# Altium schematic sheet RAM_LPDDR4.SchDoc
size A3; SheetNumber: 12; SheetTotal: 22
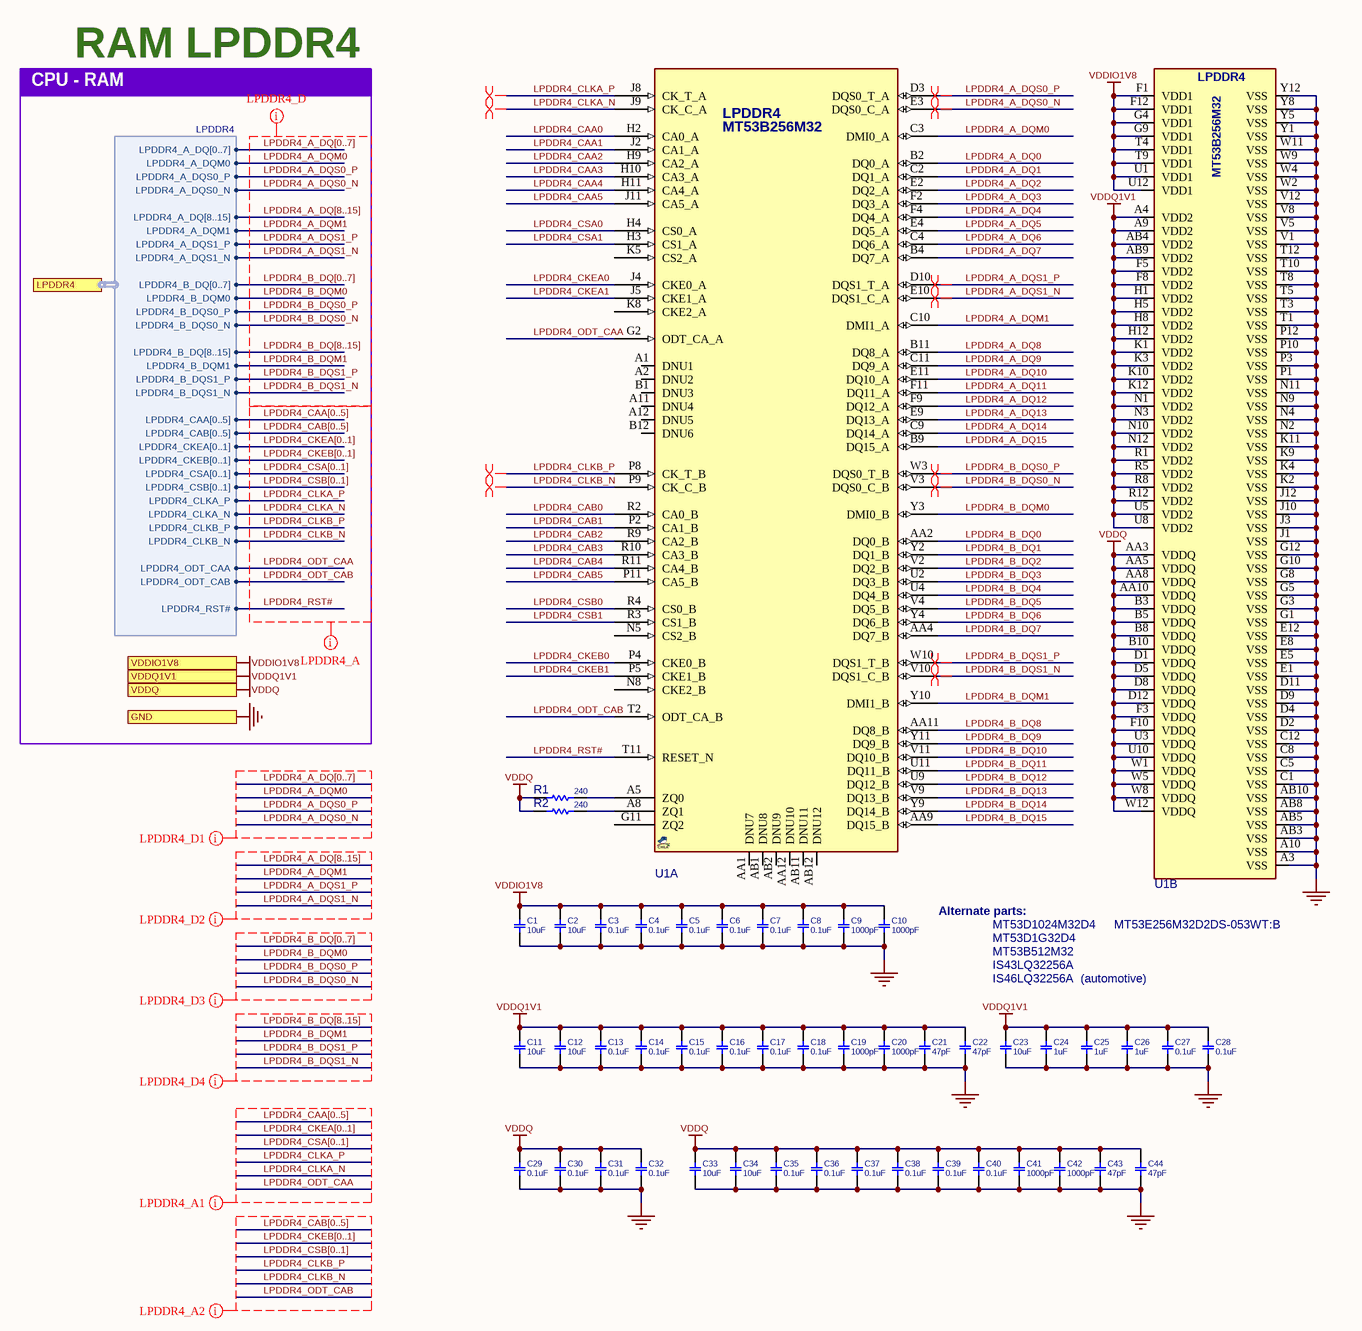
[diagram p0: RAM_LPDDR4.SchDoc]

## Parts
C1  10uF  [C0402A]
C2  10uF  [C0402A]
C3  0.1uF  [C0402A]
C4  0.1uF  [C0402A]
C5  0.1uF  [C0402A]
C6  0.1uF  [C0402A]
C7  0.1uF  [C0402A]
C8  0.1uF  [C0402A]
C9  1000pF  [C0402A]
C10  1000pF  [C0402A]
C11  10uF  [C0402A]
C12  10uF  [C0402A]
C13  0.1uF  [C0402A]
C14  0.1uF  [C0402A]
C15  0.1uF  [C0402A]
C16  0.1uF  [C0402A]
C17  0.1uF  [C0402A]
C18  0.1uF  [C0402A]
C19  1000pF  [C0402A]
C20  1000pF  [C0402A]
C21  47pF  [C0402A]
C22  47pF  [C0402A]
C23  10uF  [C0402A]
C24  1uF  [C0402A]
C25  1uF  [C0402A]
C26  1uF  [C0402A]
C27  0.1uF  [C0402A]
C28  0.1uF  [C0402A]
C29  0.1uF  [C0402A]
C30  0.1uF  [C0402A]
C31  0.1uF  [C0402A]
C32  0.1uF  [C0402A]
C33  10uF  [C0402A]
C34  10uF  [C0402A]
C35  0.1uF  [C0402A]
C36  0.1uF  [C0402A]
C37  0.1uF  [C0402A]
C38  0.1uF  [C0402A]
C39  0.1uF  [C0402A]
C40  0.1uF  [C0402A]
C41  1000pF  [C0402A]
C42  1000pF  [C0402A]
C43  47pF  [C0402A]
C44  47pF  [C0402A]
R1  240  [R0402A]
R2  240  [R0402A]
U1  LPDDR4_MT53B256M32  [BGA65_200_11x14]  (value not drawn)  (parts A,B of 2)

## Ports
GND, LPDDR4 (harness LPDDR4), VDDIO1V8, VDDQ, VDDQ1V1

## Harnesses
LPDDR4: LPDDR4_A_DQ[0..7], LPDDR4_A_DQM0, LPDDR4_A_DQS0_P, LPDDR4_A_DQS0_N, LPDDR4_A_DQ[8..15], LPDDR4_A_DQM1, LPDDR4_A_DQS1_P, LPDDR4_A_DQS1_N, LPDDR4_B_DQ[0..7], LPDDR4_B_DQM0, LPDDR4_B_DQS0_P, LPDDR4_B_DQS0_N, LPDDR4_B_DQ[8..15], LPDDR4_B_DQM1, LPDDR4_B_DQS1_P, LPDDR4_B_DQS1_N, LPDDR4_CAA[0..5], LPDDR4_CAB[0..5], LPDDR4_CKEA[0..1], LPDDR4_CKEB[0..1], LPDDR4_CSA[0..1], LPDDR4_CSB[0..1], LPDDR4_CLKA_P, LPDDR4_CLKA_N, LPDDR4_CLKB_P, LPDDR4_CLKB_N, LPDDR4_RST#, LPDDR4_ODT_CAA, LPDDR4_ODT_CAB

## Nets
GND: C1.1 C2.1 C3.1 C4.1 C5.1 C6.1 C7.1 C8.1 C9.1 C10.1 C11.1 C12.1 C13.1 C14.1 C15.1 C16.1 C17.1 C18.1 C19.1 C20.1 C21.1 C22.1 C23.1 C24.1 C25.1 C26.1 C27.1 C28.1 C29.1 C30.1 C31.1 C32.1 C33.1 C34.1 C35.1 C36.1 C37.1 C38.1 C39.1 C40.1 C41.1 C42.1 C43.1 C44.1 U1.A3(VSS) U1.A10(VSS) U1.AB3(VSS) U1.AB5(VSS) U1.AB8(VSS) U1.AB10(VSS) U1.C1(VSS) U1.C5(VSS) U1.C8(VSS) U1.C12(VSS) U1.D2(VSS) U1.D4(VSS) U1.D9(VSS) U1.D11(VSS) U1.E1(VSS) U1.E5(VSS) U1.E8(VSS) U1.E12(VSS) U1.G1(VSS) U1.G3(VSS) U1.G5(VSS) U1.G8(VSS) U1.G10(VSS) U1.G12(VSS) U1.J1(VSS) U1.J3(VSS) U1.J10(VSS) U1.J12(VSS) U1.K2(VSS) U1.K4(VSS) U1.K9(VSS) U1.K11(VSS) U1.N2(VSS) U1.N4(VSS) U1.N9(VSS) U1.N11(VSS) U1.P1(VSS) U1.P3(VSS) U1.P10(VSS) U1.P12(VSS) U1.T1(VSS) U1.T3(VSS) U1.T5(VSS) U1.T8(VSS) U1.T10(VSS) U1.T12(VSS) U1.V1(VSS) U1.V5(VSS) U1.V8(VSS) U1.V12(VSS) U1.W2(VSS) U1.W4(VSS) U1.W9(VSS) U1.W11(VSS) U1.Y1(VSS) U1.Y5(VSS) U1.Y8(VSS) U1.Y12(VSS) ; port GND
VDDIO1V8: C1.2 C2.2 C3.2 C4.2 C5.2 C6.2 C7.2 C8.2 C9.2 C10.2 U1.F1(VDD1) U1.F12(VDD1) U1.G4(VDD1) U1.G9(VDD1) U1.T4(VDD1) U1.T9(VDD1) U1.U1(VDD1) U1.U12(VDD1) ; port VDDIO1V8
VDDQ: C29.2 C30.2 C31.2 C32.2 C33.2 C34.2 C35.2 C36.2 C37.2 C38.2 C39.2 C40.2 C41.2 C42.2 C43.2 C44.2 R1.1 R2.1 U1.AA3(VDDQ) U1.AA5(VDDQ) U1.AA8(VDDQ) U1.AA10(VDDQ) U1.B3(VDDQ) U1.B5(VDDQ) U1.B8(VDDQ) U1.B10(VDDQ) U1.D1(VDDQ) U1.D5(VDDQ) U1.D8(VDDQ) U1.D12(VDDQ) U1.F3(VDDQ) U1.F10(VDDQ) U1.U3(VDDQ) U1.U10(VDDQ) U1.W1(VDDQ) U1.W5(VDDQ) U1.W8(VDDQ) U1.W12(VDDQ) ; port VDDQ
VDDQ1V1: C11.2 C12.2 C13.2 C14.2 C15.2 C16.2 C17.2 C18.2 C19.2 C20.2 C21.2 C22.2 C23.2 C24.2 C25.2 C26.2 C27.2 C28.2 U1.A4(VDD2) U1.A9(VDD2) U1.AB4(VDD2) U1.AB9(VDD2) U1.F5(VDD2) U1.F8(VDD2) U1.H1(VDD2) U1.H5(VDD2) U1.H8(VDD2) U1.H12(VDD2) U1.K1(VDD2) U1.K3(VDD2) U1.K10(VDD2) U1.K12(VDD2) U1.N1(VDD2) U1.N3(VDD2) U1.N10(VDD2) U1.N12(VDD2) U1.R1(VDD2) U1.R5(VDD2) U1.R8(VDD2) U1.R12(VDD2) U1.U5(VDD2) U1.U8(VDD2) ; port VDDQ1V1
LPDDR4_A_DQ0: U1.B2(DQ0_A)
LPDDR4_A_DQ1: U1.C2(DQ1_A)
LPDDR4_A_DQ2: U1.E2(DQ2_A)
LPDDR4_A_DQ3: U1.F2(DQ3_A)
LPDDR4_A_DQ4: U1.F4(DQ4_A)
LPDDR4_A_DQ5: U1.E4(DQ5_A)
LPDDR4_A_DQ6: U1.C4(DQ6_A)
LPDDR4_A_DQ7: U1.B4(DQ7_A)
LPDDR4_A_DQ8: U1.B11(DQ8_A)
LPDDR4_A_DQ9: U1.C11(DQ9_A)
LPDDR4_A_DQ10: U1.E11(DQ10_A)
LPDDR4_A_DQ11: U1.F11(DQ11_A)
LPDDR4_A_DQ12: U1.F9(DQ12_A)
LPDDR4_A_DQ13: U1.E9(DQ13_A)
LPDDR4_A_DQ14: U1.C9(DQ14_A)
LPDDR4_A_DQ15: U1.B9(DQ15_A)
LPDDR4_A_DQM0: U1.C3(DMI0_A) ; port LPDDR4.LPDDR4_A_DQM0
LPDDR4_A_DQM1: U1.C10(DMI1_A) ; port LPDDR4.LPDDR4_A_DQM1
LPDDR4_A_DQS0_N: U1.E3(DQS0_C_A) ; port LPDDR4.LPDDR4_A_DQS0_N
LPDDR4_A_DQS0_P: U1.D3(DQS0_T_A) ; port LPDDR4.LPDDR4_A_DQS0_P
LPDDR4_A_DQS1_N: U1.E10(DQS1_C_A) ; port LPDDR4.LPDDR4_A_DQS1_N
LPDDR4_A_DQS1_P: U1.D10(DQS1_T_A) ; port LPDDR4.LPDDR4_A_DQS1_P
LPDDR4_B_DQ0: U1.AA2(DQ0_B)
LPDDR4_B_DQ1: U1.Y2(DQ1_B)
LPDDR4_B_DQ2: U1.V2(DQ2_B)
LPDDR4_B_DQ3: U1.U2(DQ3_B)
LPDDR4_B_DQ4: U1.U4(DQ4_B)
LPDDR4_B_DQ5: U1.V4(DQ5_B)
LPDDR4_B_DQ6: U1.Y4(DQ6_B)
LPDDR4_B_DQ7: U1.AA4(DQ7_B)
LPDDR4_B_DQ8: U1.AA11(DQ8_B)
LPDDR4_B_DQ9: U1.Y11(DQ9_B)
LPDDR4_B_DQ10: U1.V11(DQ10_B)
LPDDR4_B_DQ11: U1.U11(DQ11_B)
LPDDR4_B_DQ12: U1.U9(DQ12_B)
LPDDR4_B_DQ13: U1.V9(DQ13_B)
LPDDR4_B_DQ14: U1.Y9(DQ14_B)
LPDDR4_B_DQ15: U1.AA9(DQ15_B)
LPDDR4_B_DQM0: U1.Y3(DMI0_B) ; port LPDDR4.LPDDR4_B_DQM0
LPDDR4_B_DQM1: U1.Y10(DMI1_B) ; port LPDDR4.LPDDR4_B_DQM1
LPDDR4_B_DQS0_N: U1.V3(DQS0_C_B) ; port LPDDR4.LPDDR4_B_DQS0_N
LPDDR4_B_DQS0_P: U1.W3(DQS0_T_B) ; port LPDDR4.LPDDR4_B_DQS0_P
LPDDR4_B_DQS1_N: U1.V10(DQS1_C_B) ; port LPDDR4.LPDDR4_B_DQS1_N
LPDDR4_B_DQS1_P: U1.W10(DQS1_T_B) ; port LPDDR4.LPDDR4_B_DQS1_P
LPDDR4_CAA0: U1.H2(CA0_A)
LPDDR4_CAA1: U1.J2(CA1_A)
LPDDR4_CAA2: U1.H9(CA2_A)
LPDDR4_CAA3: U1.H10(CA3_A)
LPDDR4_CAA4: U1.H11(CA4_A)
LPDDR4_CAA5: U1.J11(CA5_A)
LPDDR4_CAB0: U1.R2(CA0_B)
LPDDR4_CAB1: U1.P2(CA1_B)
LPDDR4_CAB2: U1.R9(CA2_B)
LPDDR4_CAB3: U1.R10(CA3_B)
LPDDR4_CAB4: U1.R11(CA4_B)
LPDDR4_CAB5: U1.P11(CA5_B)
LPDDR4_CKEA0: U1.J4(CKE0_A)
LPDDR4_CKEA1: U1.J5(CKE1_A)
LPDDR4_CKEB0: U1.P4(CKE0_B)
LPDDR4_CKEB1: U1.P5(CKE1_B)
LPDDR4_CLKA_N: U1.J9(CK_C_A) ; port LPDDR4.LPDDR4_CLKA_N
LPDDR4_CLKA_P: U1.J8(CK_T_A) ; port LPDDR4.LPDDR4_CLKA_P
LPDDR4_CLKB_N: U1.P9(CK_C_B) ; port LPDDR4.LPDDR4_CLKB_N
LPDDR4_CLKB_P: U1.P8(CK_T_B) ; port LPDDR4.LPDDR4_CLKB_P
LPDDR4_CSA0: U1.H4(CS0_A)
LPDDR4_CSA1: U1.H3(CS1_A)
LPDDR4_CSB0: U1.R4(CS0_B)
LPDDR4_CSB1: U1.R3(CS1_B)
LPDDR4_ODT_CAA: U1.G2(ODT_CA_A) ; port LPDDR4.LPDDR4_ODT_CAA
LPDDR4_ODT_CAB: U1.T2(ODT_CA_B) ; port LPDDR4.LPDDR4_ODT_CAB
LPDDR4_RST#: U1.T11(RESET_N) ; port LPDDR4.LPDDR4_RST#
NetR1_2: R1.2 U1.A5(ZQ0)
NetR2_2: R2.2 U1.A8(ZQ1)

Not connected (* = marked no-connect by the designer): U1 A1(DNU1) A2(DNU2) A11(DNU4) A12(DNU5) AA1(DNU7) AA12(DNU10) AB1(DNU8) AB2(DNU9) AB11(DNU11) AB12(DNU12) B1(DNU3) B12(DNU6) G11(ZQ2) K5(CS2_A) K8(CKE2_A) N5(CS2_B) N8(CKE2_B)

## Buses and harness runs
bus LPDDR4_A_DQ[0..7]
bus LPDDR4_A_DQ[8..15]
bus LPDDR4_B_DQ[0..7]
bus LPDDR4_B_DQ[8..15]
bus LPDDR4_CAA[0..5]
bus LPDDR4_CAB[0..5]
bus LPDDR4_CKEA[0..1]
bus LPDDR4_CKEB[0..1]
bus LPDDR4_CSA[0..1]
bus LPDDR4_CSB[0..1]

## Layout directives
net class LPDDR4_D: LPDDR4_A_DQ[0..7], LPDDR4_A_DQ[8..15], LPDDR4_A_DQM0, LPDDR4_A_DQM1, LPDDR4_A_DQS0_N, LPDDR4_A_DQS0_P, LPDDR4_A_DQS1_N, LPDDR4_A_DQS1_P, LPDDR4_B_DQ[0..7], LPDDR4_B_DQ[8..15], LPDDR4_B_DQM0, LPDDR4_B_DQM1, LPDDR4_B_DQS0_N, LPDDR4_B_DQS0_P, LPDDR4_B_DQS1_N, LPDDR4_B_DQS1_P
net class LPDDR4_A: LPDDR4_CAA[0..5], LPDDR4_CAB[0..5], LPDDR4_CKEA[0..1], LPDDR4_CKEB[0..1], LPDDR4_CLKA_N, LPDDR4_CLKA_P, LPDDR4_CLKB_N, LPDDR4_CLKB_P, LPDDR4_CSA[0..1], LPDDR4_CSB[0..1], LPDDR4_ODT_CAA, LPDDR4_ODT_CAB, LPDDR4_RST#
differential pair: LPDDR4_A_DQS0_N, LPDDR4_A_DQS0_P, LPDDR4_A_DQS1_N, LPDDR4_A_DQS1_P, LPDDR4_B_DQS0_N, LPDDR4_B_DQS0_P, LPDDR4_B_DQS1_N, LPDDR4_B_DQS1_P, LPDDR4_CLKA_N, LPDDR4_CLKA_P, LPDDR4_CLKB_N, LPDDR4_CLKB_P
net class LPDDR4_D1: LPDDR4_A_DQ[0..7], LPDDR4_A_DQM0, LPDDR4_A_DQS0_N, LPDDR4_A_DQS0_P
net class LPDDR4_D2: LPDDR4_A_DQ[8..15], LPDDR4_A_DQM1, LPDDR4_A_DQS1_N, LPDDR4_A_DQS1_P
net class LPDDR4_D3: LPDDR4_B_DQ[0..7], LPDDR4_B_DQM0, LPDDR4_B_DQS0_N, LPDDR4_B_DQS0_P
net class LPDDR4_D4: LPDDR4_B_DQ[8..15], LPDDR4_B_DQM1, LPDDR4_B_DQS1_N, LPDDR4_B_DQS1_P
net class LPDDR4_A1: LPDDR4_CAA[0..5], LPDDR4_CKEA[0..1], LPDDR4_CLKA_N, LPDDR4_CLKA_P, LPDDR4_CSA[0..1], LPDDR4_ODT_CAA
net class LPDDR4_A2: LPDDR4_CAB[0..5], LPDDR4_CKEB[0..1], LPDDR4_CLKB_N, LPDDR4_CLKB_P, LPDDR4_CSB[0..1], LPDDR4_ODT_CAB

## Notes on the sheet
- CPU - RAM
- RAM LPDDR4
- Alternate parts:
- MT53B512M32
- IS43LQ32256A
- MT53D1024M32D4
- MT53D1G32D4
- MT53E256M32D2DS-053WT:B
- IS46LQ32256A  (automotive)
- (in symbol LPDDR4_MT53B256M32_BGA200, part A) LPDDR4; MT53B256M32
- (in symbol LPDDR4_MT53B256M32_BGA200, part B) LPDDR4; MT53B256M32

## Library data of the parts
C1 C2 C11 C12 C23 C33 C34 = CAP_SMD_MLCC: CAP, MLCC; PARAM: X5R, 20%; MANF_P#: CL05A106MP5NUNC; MANF: Samsung; PRICE: 100= 1$; PARAM2: -; ASSEMBLY: ASSEMBLY; VALUE: 10uF
C3-C8 C13-C18 C27-C32 C35-C40 = CAP_SMD_MLCC: CAP, MLCC; PARAM: X5R, 10%; MANF_P#: GRM155R61E104; MANF: Murata; PARAM2: 25v; PRICE: 10,000:$0.006; ASSEMBLY: ASSEMBLY; VALUE: 0.1uF
C9 C10 C19 C20 C41 C42 = CAP_SMD_MLCC: CAP, MLCC; PARAM: C0G, 5%; MANF_P#: CC0402JRNPO9BN102; MANF: Yageo; PARAM2: 50v; PRICE: 100= 1$; ASSEMBLY: ASSEMBLY; VALUE: 1000pF
C21 C22 C24-C26 C43 C44 = CAP_SMD_MLCC: CAP, MLCC; PARAM: -; PRICE: 100= 1$; MANF_P#: -; MANF: -; PARAM2: -; ASSEMBLY: ASSEMBLY
  C21 C22 C43 C44: VALUE: 47pF
  C24-C26: VALUE: 1uF
R1 R2 = RES_SMD: RESISTOR, SMD; PARAM: -W; DESC: DESCRIPTION; DIST#: MOUSER; PARAM2: 1%; MANF_P#: -; MANF: -; ASSEMBLY: ASSEMBLY; PRICE: 100= 0.5$; VALUE: 240
U1 = LPDDR4_MT53B256M32_BGA200: LPDDR4 SDRAM, 8Gb (256Mb X32), 200-WFBGA; MANF_P#: MT53B256M32D1GZ-062 AIT:B; MANF: Micron Technology; PARAM: 8Gb (256Mb X32), 2133MHz; PARAM2: 1.8Vdd1, 1.1Vdd2, 1.1Vddq, -40~95oC; ASSEMBLY: ASSEMBLY; PRICE: -$; VALUE: LPDDR4_MT53B256M32